# Altium schematic sheet Soldeerbord.SchDoc
size A4; SheetNumber: 1; SheetTotal: 2
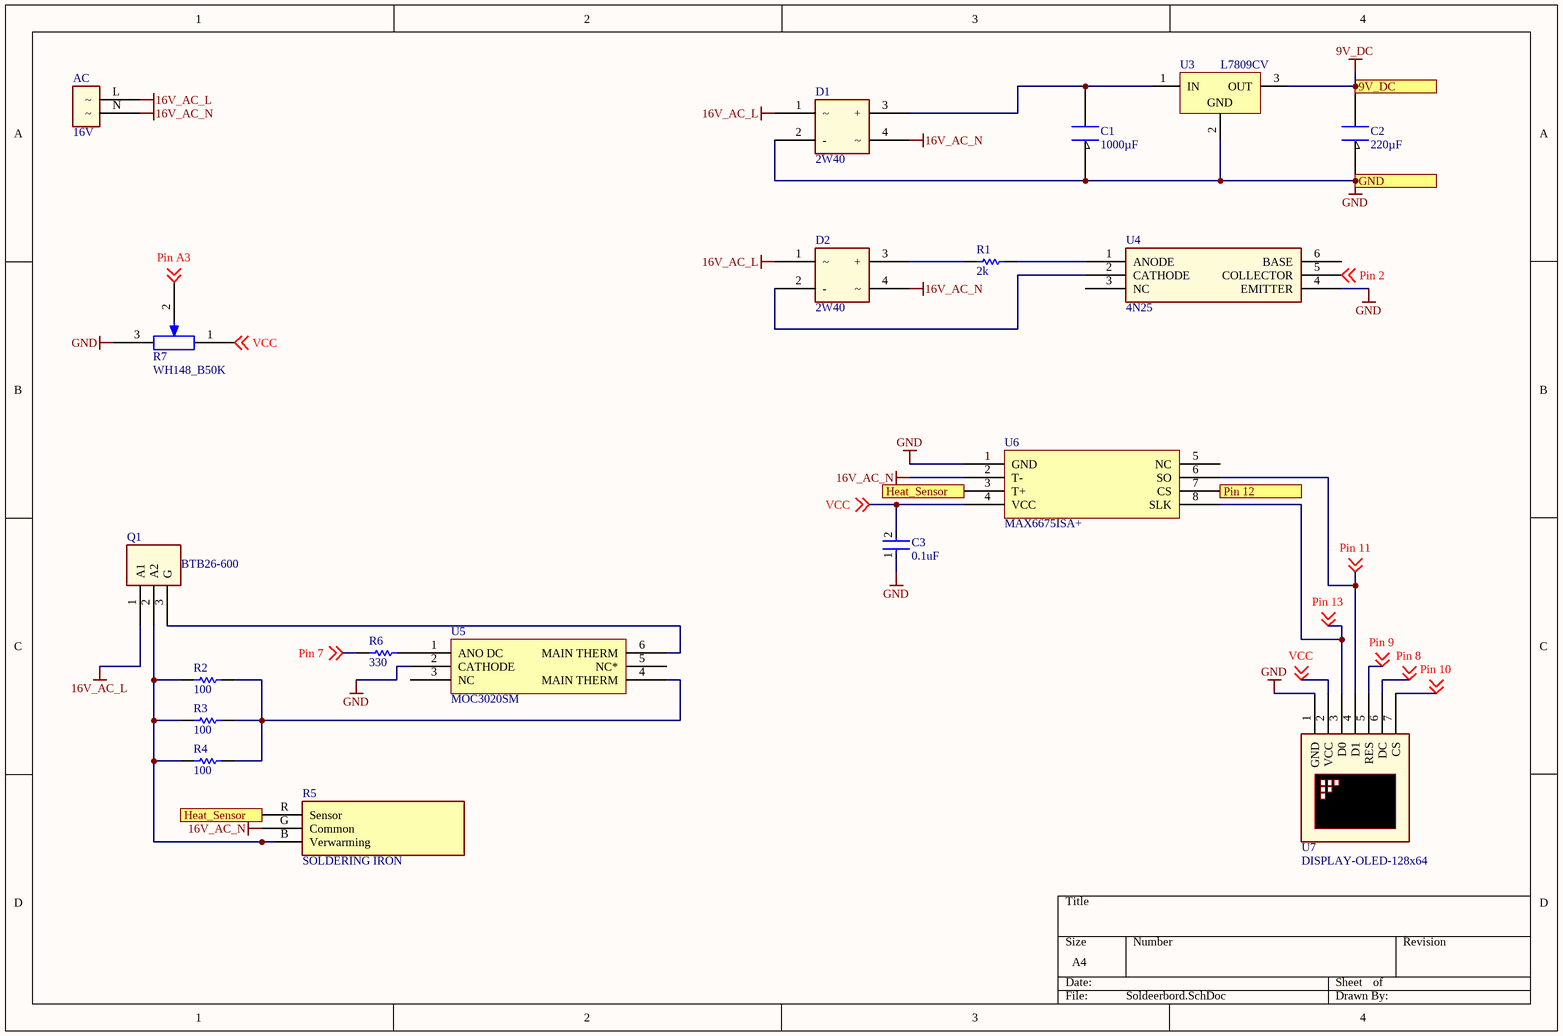
[diagram p0: Soldeerbord.SchDoc]

## Parts
AC  16V  [PCB_Voeding_16V_AC]
C1  1000µF  [PCB-Capasitor]
C2  220µF  [PCB-Capasitor]
C3  0.1uF  [FP-GRM188-0_1-e0_2_0_55-IPC_A]
D1  2W40  [PCB_2W40]
D2  2W40  [PCB_2W40]
Q1  BTB26-600  [BTB26-600B]
R1  2k  [RESC2013X50X30LL20T20]
R2  100  [RESC2013X50X30LL20T20]
R3  100  [RESC2013X50X30LL20T20]
R4  100  [RESC2013X50X30LL20T20]
R5  SOLDERING IRON  [PCB_Soldering_Iron]
R6  330  [RESC2013X50X30LL20T20]
R7  WH148_B50K  [PCBC_WH148_B50K]
U3  L7809CV  [TO220]
U4  4N25  [4N25-300E]
U5  MOC3020SM  [SOP254P920X508-6N]
U6  MAX6675ISA+  [SOP127P600X175-8N]
U7  DISPLAY-OLED-128x64  [PCB_SPI_OLED_7pin]

## Ports
9V_DC, GND, Heat_Sensor, Pin 12

## Nets
9V_DC: C2.1 U3.3(OUT) ; port 9V_DC
16V_AC_L: AC.L D1.1 D2.1 Q1.1(A1)
16V_AC_N: AC.N D1.4 D2.4 R5.G(Common) U6.2(T-)
GND: C1.2 C2.2 C3.1 D1.2(-) R7.3 U3.2(GND) U4.4(EMITTER) U5.2(CATHODE) U6.1(GND) U7.1(GND) ; port GND
Heat_Sensor: R5.R(Sensor) U6.3(T+) ; port Heat_Sensor
Pin 2: U4.5(COLLECTOR) ; off-sheet Pin 2
Pin 7: R6.1 ; off-sheet Pin 7
Pin 8: U7.6(DC) ; off-sheet Pin 8
Pin 9: U7.5(RES) ; off-sheet Pin 9
Pin 10: U7.7(CS) ; off-sheet Pin 10
Pin 11: U6.6(SO) U7.4(D1) ; off-sheet Pin 11
Pin 12: U6.7(CS) ; port Pin 12
Pin 13: U6.8(SLK) U7.3(D0) ; off-sheet Pin 13
Pin A3: R7.2 ; off-sheet Pin A3
VCC: C3.2 R7.1 U6.4(VCC) U7.2(VCC) ; off-sheet VCC
NetC1_1: C1.1 D1.3(+) U3.1(IN)
NetD2_2: D2.2(-) U4.2(CATHODE)
NetD2_3: D2.3(+) R1.1
NetQ1_2: Q1.2(A2) R2.1 R3.1 R4.1 R5.B(Verwarming)
NetQ1_3: Q1.3(G) U5.6(MAIN_THERM)
NetR1_2: R1.2 U4.1(ANODE)
NetR2_2: R2.2 R3.2 R4.2 U5.4(MAIN_THERM)
NetR6_2: R6.2 U5.1(ANO_DC)

Not connected (* = marked no-connect by the designer): U4 3(NC) 6(BASE); U5 3(NC) 5(NC*); U6 5(NC)

## Library data of the parts
AC = Voeding_16V_AC
C1 C2 = Capasitor
C3 = CMP-2006-02792-2: Chip Multilayer Ceramic Capacitors for General Purpose, 0603, 10uF, X5R, 15%, 20%, 6.3V; Packaging: Tape and Reel; Voltage Rating (DC): 6.3V; Width: 0.031inch; Termination: SMD/SMT; Dielectric: X5R; Package Quantity: 4000; Voltage Rating: 6.3V; Capacitance: 10uF; Case/Package: 0603; Min Operating Temperature: -55°C; Voltage: 6.3V; Length: 1.6mm; Thickness: 0.035inch; Lead Free: Lead Free; Depth: 0.8mm; Case Code (Imperial): 0603; Max Operating Temperature: 85°C; Material: Ceramic; Height: 0.8mm; Tolerance: 20%; Mount: Surface Mount; REACH SVHC: No SVHC; Radiation Hardening: No; Case Code (Metric): 1608
Q1 = BTB26-600B
R1-R4 R6 = CMP-2001-04896-1: Manufacturer: Vishay Dale; Part Number: CRCW08050000Z0EA
R5 = Soldering_Iron
U3 = CMP-0244-00424-1: Positive Voltage Regulator, 24V, 3-Pin TO-220; ComponentLink3Description: Package Specification; DatasheetVersion: 16/11/2011; ComponentLink1Description: Manufacturer URL; PackageReference: TO220; ComponentLink2Description: Datasheet; PackageVersion: ver3.0; ComponentLink3URL: http://www.st.com/internet/com/TECHNICAL_RESOURCES/TECHNICAL_LITERATURE/PACKAGE_INFORMATION/CD00004649.pdf; ComponentLink1URL: http://www.st.com; PackageDescription: TO, Thru-Hole, Vertical, Heatsink Mounted; 3 In-Line Leads; Pitch 2.54 mm; ComponentLink2URL: http://www.st.com/internet/com/TECHNICAL_RESOURCES/TECHNICAL_LITERATURE/DATASHEET/CD00000444.pdf
U4 = 4N25-300E
U7 = SPI_OLED_7Pin